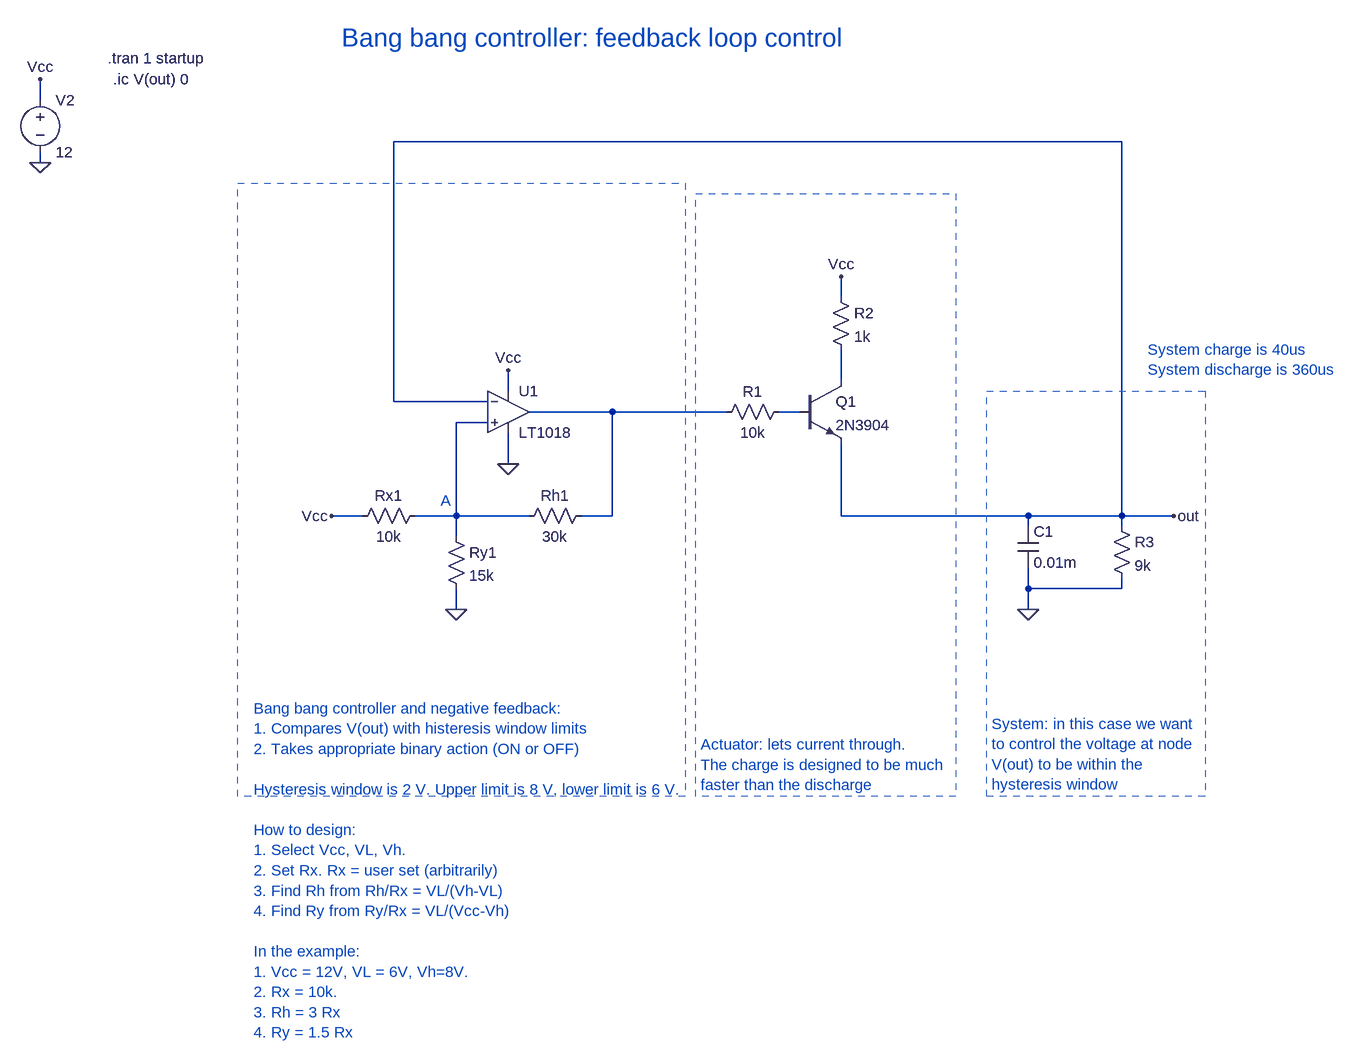
[diagram p0: schematic Bang-bang-control.asc]
Bang-bang-control.asc, the LTspice schematic file:
Version 4
SHEET 1 2572 1076
WIRE -400 -416 -400 -448
WIRE 1264 -352 144 -352
WIRE -400 -320 -400 -336
WIRE 832 -112 832 -144
WIRE 832 16 832 -32
WIRE 320 32 320 0
WIRE 144 48 144 -352
WIRE 288 48 144 48
WIRE 480 64 352 64
WIRE 656 64 480 64
WIRE 768 64 736 64
WIRE 288 80 240 80
WIRE 320 144 320 96
WIRE 96 224 48 224
WIRE 240 224 240 80
WIRE 240 224 176 224
WIRE 352 224 240 224
WIRE 480 224 480 64
WIRE 480 224 432 224
WIRE 832 224 832 112
WIRE 1120 224 832 224
WIRE 1264 224 1264 -352
WIRE 1264 224 1120 224
WIRE 1344 224 1264 224
WIRE 1120 240 1120 224
WIRE 1264 240 1264 224
WIRE 240 256 240 224
WIRE 1120 336 1120 304
WIRE 1264 336 1264 320
WIRE 1264 336 1120 336
WIRE 240 368 240 336
WIRE 1120 368 1120 336
FLAG -400 -320 0
FLAG -400 -448 Vcc
FLAG 320 0 Vcc
FLAG 240 368 0
FLAG 48 224 Vcc
FLAG 320 144 0
FLAG 832 -144 Vcc
FLAG 1120 368 0
FLAG 1344 224 out
SYMBOL Comparators\\LT1018 320 64 R0
SYMATTR InstName U1
SYMBOL voltage -400 -432 R0
WINDOW 123 0 0 Left 0
WINDOW 39 0 0 Left 0
SYMATTR InstName V2
SYMATTR Value 12
SYMBOL res 192 208 R90
WINDOW 0 0 56 VBottom 2
WINDOW 3 32 56 VTop 2
SYMATTR InstName Rx1
SYMATTR Value 10k
SYMBOL res 224 240 R0
SYMATTR InstName Ry1
SYMATTR Value 15k
SYMBOL res 448 208 R90
WINDOW 0 0 56 VBottom 2
WINDOW 3 32 56 VTop 2
SYMATTR InstName Rh1
SYMATTR Value 30k
SYMBOL res 752 48 R90
WINDOW 0 0 56 VBottom 2
WINDOW 3 32 56 VTop 2
SYMATTR InstName R1
SYMATTR Value 10k
SYMBOL npn 768 16 R0
SYMATTR InstName Q1
SYMATTR Value 2N3904
SYMBOL res 816 -128 R0
SYMATTR InstName R2
SYMATTR Value 1k
SYMBOL cap 1104 240 R0
SYMATTR InstName C1
SYMATTR Value 0.01m
SYMBOL res 1248 224 R0
SYMATTR InstName R3
SYMATTR Value 9k
TEXT -296 -480 Left 2 !.tran 1 startup
TEXT 64 -512 Left 4 ;Bang bang controller: feedback loop control
TEXT 216 200 Left 2 ;A
TEXT -288 -448 Left 2 !.ic V(out) 0
TEXT 616 576 Left 2 ;Actuator: lets current through.\nThe charge is designed to be much\nfaster than the discharge
TEXT 1064 544 Left 2 ;System: in this case we want\nto control the voltage at node\nV(out) to be within the\nhysteresis window
TEXT -72 520 Left 2 ;Bang bang controller and negative feedback:\n1. Compares V(out) with histeresis window limits\n2. Takes appropriate binary action (ON or OFF)\n \nHysteresis window is 2 V. Upper limit is 8 V, lower limit is 6 V.\n \nHow to design:\n1. Select Vcc, VL, Vh.\n2. Set Rx. Rx = user set (arbitrarily)\n3. Find Rh from Rh/Rx = VL/(Vh-VL)\n4. Find Ry from Ry/Rx = VL/(Vcc-Vh)\n \nIn the example:\n1. Vcc = 12V, VL = 6V, Vh=8V.\n2. Rx = 10k.\n3. Rh = 3 Rx\n4. Ry = 1.5 Rx
TEXT 1304 -32 Left 2 ;System charge is 40us\nSystem discharge is 360us
RECTANGLE Normal 1392 656 1056 32 2
RECTANGLE Normal 1008 656 608 -272 2
RECTANGLE Normal 592 656 -96 -288 2

The netlist it stands for:
* Bang-bang-control.asc
XU1 N004 out Vcc 0 N002 LT1018  ; pins In+ In- V+ V- OUT
V2 Vcc 0 12
Rx1 N004 Vcc 10k
Ry1 N004 0 15k
Rh1 N002 N004 30k
R1 N003 N002 10k
Q1 N001 N003 out 0 2N3904
R2 Vcc N001 1k
C1 out 0 0.01m
R3 out 0 9k
.model NPN NPN
.model PNP PNP
.lib standard.bjt
.tran 1 startup
* Bang bang controller: feedback loop control
* A
.ic V(out) 0
* Actuator: lets current through.
* The charge is designed to be much
* faster than the discharge
* System: in this case we want
* to control the voltage at node
* V(out) to be within the
* hysteresis window
* Bang bang controller and negative feedback:
* 1. Compares V(out) with histeresis window limits
* 2. Takes appropriate binary action (ON or OFF)
* Hysteresis window is 2 V. Upper limit is 8 V, lower limit is 6 V.
* How to design:
* 1. Select Vcc, VL, Vh.
* 2. Set Rx. Rx = user set (arbitrarily)
* 3. Find Rh from Rh/Rx = VL/(Vh-VL)
* 4. Find Ry from Ry/Rx = VL/(Vcc-Vh)
* In the example:
* 1. Vcc = 12V, VL = 6V, Vh=8V.
* 2. Rx = 10k.
* 3. Rh = 3 Rx
* 4. Ry = 1.5 Rx
* System charge is 40us
* System discharge is 360us
.lib LTC1.lib
.backanno
.end